# EAGLE schematic Hardware Schematic (EAGLE 7.6.0)
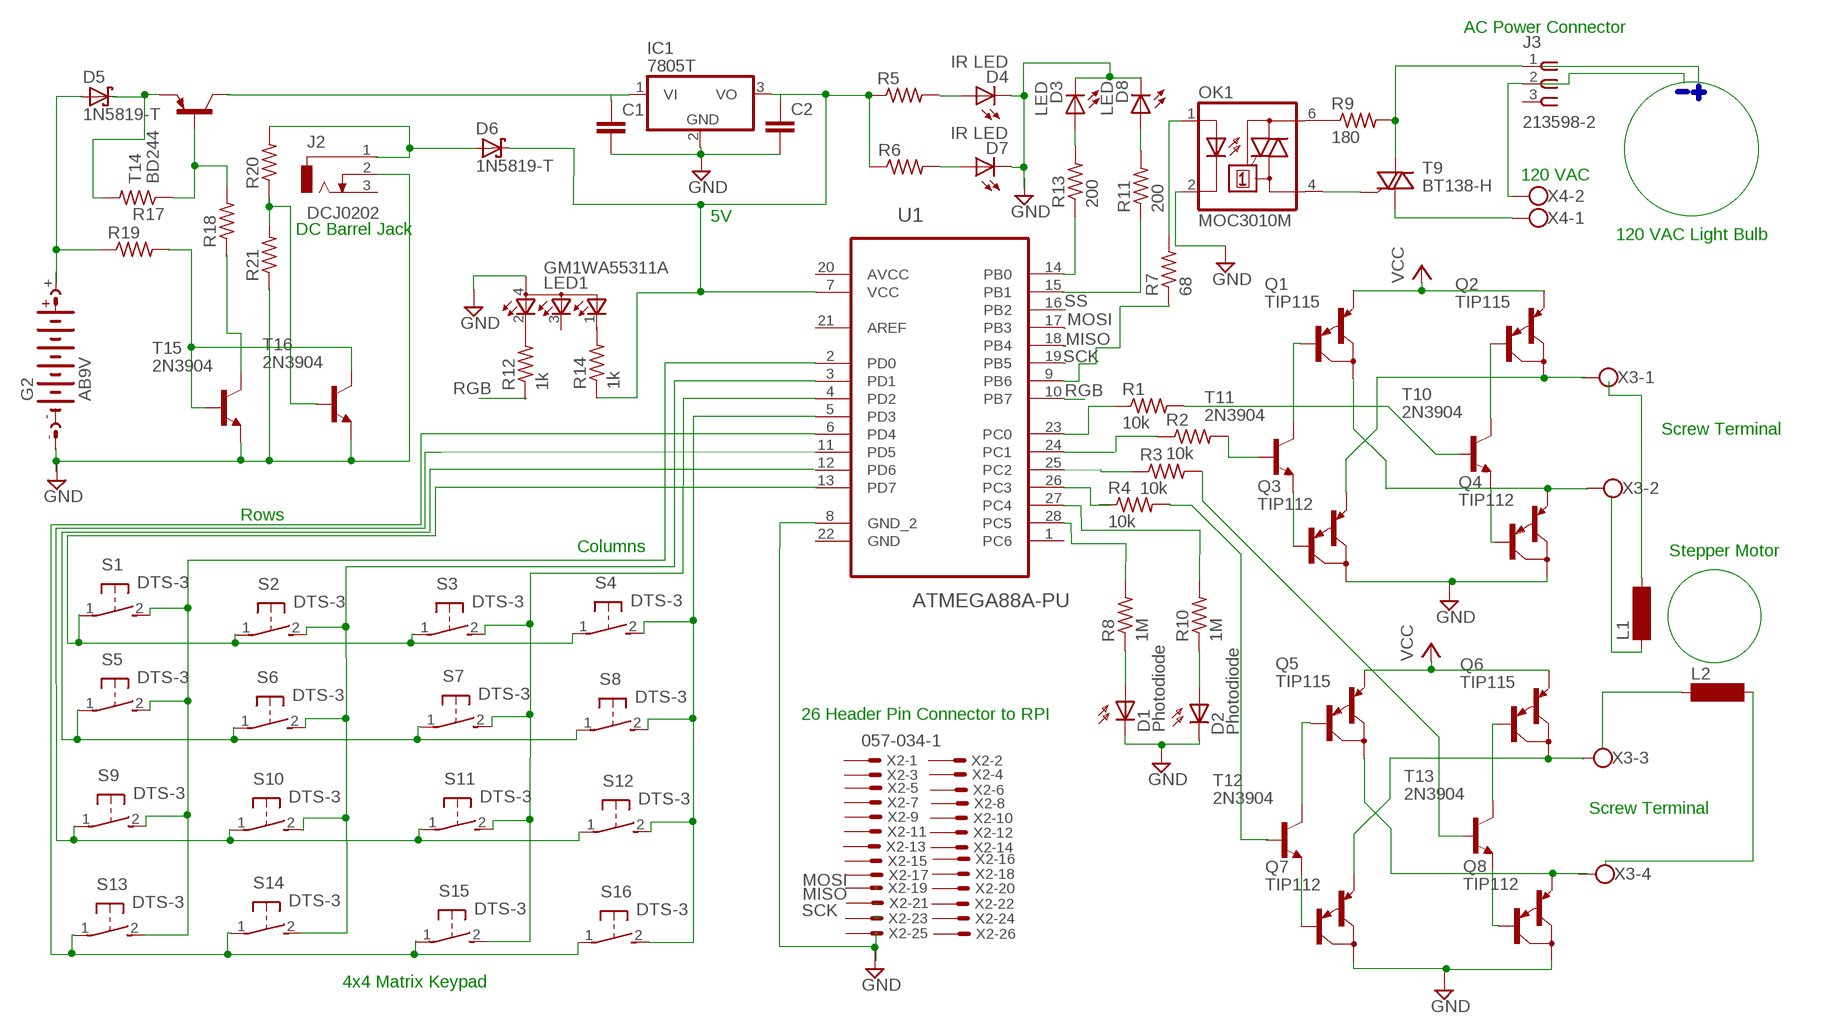
[diagram p0: schematic, sheet 1]

## Parts
C1  C22/6  [C22.5B6]
C2  C22/6  [C22.5B6]
D1  Photodiode  BPW32  [BPW32]
D2  Photodiode  BPW32  [BPW32]
D3  LED  SFH482  [SFH482]
D4  IR LED  SFH482  [SFH482]
D5  1N5819-T  [DO41-7.6]
D6  1N5819-T  [DO41-7.6]
D7  IR LED  SFH482  [SFH482]
D8  LED  SFH482  [SFH482]
G2  AB9V  [AB9V]
IC1  7805T  [TO220H]
J2  DCJ0202  [DCJ0202]
J3  213598-2  [213598-2]
L1  SM-Z15  [SM-Z15]
L2  SM-Z15  [SM-Z15]
LED1  GM1WA55311A  [GM1WA55311A]
OK1  MOC3010M  [DIL06]
Q1  TIP115  TIP125  [TO220]
Q2  TIP115  TIP125  [TO220]
Q3  TIP112  TIP125  [TO220]
Q4  TIP112  TIP125  [TO220]
Q5  TIP115  TIP125  [TO220]
Q6  TIP115  TIP125  [TO220]
Q7  TIP112  TIP125  [TO220]
Q8  TIP112  TIP125  [TO220]
R1  10k  R-US_0309/V  [0309V]
R2  10k  R-US_0309/V  [0309V]
R3  10k  R-US_0309/V  [0309V]
R4  10k  R-US_0309/V  [0309V]
R5  R-US_0309/V  [0309V]
R6  R-US_0309/V  [0309V]
R7  68  R-US_0309/12  [0309/12]
R8  1M  R-US_0309/V  [0309V]
R9  180  R-US_0309/12  [0309/12]
R10  1M  R-US_0309/V  [0309V]
R11  200  R-US_0309/V  [0309V]
R12  1k  R-US_0309/V  [0309V]
R13  200  R-US_0309/V  [0309V]
R14  1k  R-US_0309/V  [0309V]
R17  R-US_0411/15  [0411/15]
R18  R-US_0411/15  [0411/15]
R19  R-US_0411/15  [0411/15]
R20  R-US_0411/15  [0411/15]
R21  R-US_0411/15  [0411/15]
S1  DTS-3  [DTS-3]
S2  DTS-3  [DTS-3]
S3  DTS-3  [DTS-3]
S4  DTS-3  [DTS-3]
S5  DTS-3  [DTS-3]
S6  DTS-3  [DTS-3]
S7  DTS-3  [DTS-3]
S8  DTS-3  [DTS-3]
S9  DTS-3  [DTS-3]
S10  DTS-3  [DTS-3]
S11  DTS-3  [DTS-3]
S12  DTS-3  [DTS-3]
S13  DTS-3  [DTS-3]
S14  DTS-3  [DTS-3]
S15  DTS-3  [DTS-3]
S16  DTS-3  [DTS-3]
T9  BT138-H  [TO220BH]
T10  2N3904  [TO92]
T11  2N3904  [TO92]
T12  2N3904  [TO92]
T13  2N3904  [TO92]
T14  BD244  [TO220]
T15  2N3904  [TO92]
T16  2N3904  [TO92]
U1  ATMEGA88A-PU  [DIP254P762X457-28]
X2  057-034-1  [057-034-1]
X3  W237-4  [W237-4]
X4  W237-102  [W237-102]

## Nets
N$44: S16.1
N$67: R20.2
N$101: T15.2(B)
N$103: R19.1
N$105: R17.1 R18.2
N$106: J2.2 T15.3(E) T16.3(E)
N$107: R20.1
N$108: T15.1(C)
Unconnected: C1.1 C1.2 C2.1 C2.2 D1.A D1.K(C) D2.A D2.K(C) D3.A D3.K(C) D4.A D4.K(C) D5.A D5.C D6.A D6.C D7.A D7.K(C) D8.A D8.K(C) G2.+ G2.- IC1.1(VI) IC1.2(GND) IC1.3(VO) J2.1 J2.3 J3.1 J3.2 J3.3 L1.1 L1.2 L2.1 L2.2 LED1.1(CGREEN) LED1.2(CRED) LED1.3(CBLUE) LED1.4(A) OK1.1(A) OK1.2(C) OK1.4(A1) OK1.6(A2) Q1.1(B) Q1.2(C) Q1.3(E) Q2.1(B) Q2.2(C) Q2.3(E) Q3.1(B) Q3.2(C) Q3.3(E) Q4.1(B) Q4.2(C) Q4.3(E) Q5.1(B) Q5.2(C) Q5.3(E) Q6.1(B) Q6.2(C) Q6.3(E) Q7.1(B) Q7.2(C) Q7.3(E) Q8.1(B) Q8.2(C) Q8.3(E) R1.1 R1.2 R2.1 R2.2 R3.1 R3.2 R4.1 R4.2 R5.1 R5.2 R6.1 R6.2 R7.1 R7.2 R8.1 R8.2 R9.1 R9.2 R10.1 R10.2 R11.1 R11.2 R12.1 R12.2 R13.1 R13.2 R14.1 R14.2 R17.2 R18.1 R19.2 R21.1 R21.2 S1.1 S1.2 S2.1 S2.2 S3.1 S3.2 S4.1 S4.2 S5.1 S5.2 S6.1 S6.2 S7.1 S7.2 S8.1 S8.2 S9.1 S9.2 S10.1 S10.2 S11.1 S11.2 S12.1 S12.2 S13.1 S13.2 S14.1 S14.2 S15.1 S15.2 S16.2 T9.G T9.T1(A1) T9.T2(A2) T10.1(C) T10.2(B) T10.3(E) T11.1(C) T11.2(B) T11.3(E) T12.1(C) T12.2(B) T12.3(E) T13.1(C) T13.2(B) T13.3(E) T14.1(B) T14.2(C) T14.3(E) T16.1(C) T16.2(B) U1.1(PC6) U1.2(PD0) U1.3(PD1) U1.4(PD2) U1.5(PD3) U1.6(PD4) U1.8(GND_2) U1.9(PB6) U1.10(PB7) U1.11(PD5) U1.12(PD6) U1.13(PD7) U1.14(PB0) U1.15(PB1) U1.16(PB2) U1.17(PB3) U1.18(PB4) U1.19(PB5) U1.21(AREF) U1.22(GND) U1.23(PC0) U1.24(PC1) U1.25(PC2) U1.26(PC3) U1.27(PC4) U1.28(PC5) X2.1 X2.2 X2.3 X2.4 X2.5 X2.6 X2.7 X2.8 X2.9 X2.10 X2.11 X2.12 X2.13 X2.14 X2.15 X2.16 X2.17 X2.18 X2.19 X2.20 X2.21 X2.22 X2.23 X2.24 X2.25 X2.26 X2.27 X2.28 X2.29 X2.30 X2.31 X2.32 X2.33 X2.34 X3.1 X3.2 X3.3 X3.4 X4.1 X4.2

## Buses
B$1
B$2
B$3

## Notes on the sheet
- AC Power Connector
- 120 VAC
- 5V
- DC Barrel Jack
- 120 VAC Light Bulb
- Screw Terminal
- Rows
- Columns | Stepper Motor
- 26 Header Pin Connector to RPI
- Screw Terminal
- 4x4 Matrix Keypad

## Power pins joined to a net without a drawn wire
AVCC: U1.20(AVCC)
VCC: U1.7(VCC)

## Library data of the parts
C1 C2 = capacitor-wima:C: CAPACITOR naming: grid - package width
D1 D2 = opto-trans-siemens:BPW32: PHOTO DIODE; OC_FARNELL: unknown; OC_NEWARK: unknown
D3 D4 D7 D8 = led:SFH482: IR LED infrared emitting diode, Infineon
D5 D6 = diode:1N581*: 1.0A SCHOTTKY BARRIER RECTIFIER Source: http://www.diodes.com/datasheets/ds23001.pdf
G2 = battery:AB9V: 9-V BATTERY CLIP
IC1 = linear:78*: Positive VOLTAGE REGULATOR Source: http://cache.national.com/ds/LM/LM78L05.pdf http://www.fairchildsemi.com/ds/LM/LM7805.pdf
J2 = con-jack:DCJ0202: DC POWER JACK Source: DCJ0202.pdf; OC_FARNELL: unknown; OC_NEWARK: unknown
J3 = con-amp:213598-2: AC Jack Source: ENG_CD_213598_M.pdf
L1 L2 = inductor-neosid:SM-Z15: INDUCTOR SMD rod core choke; OC_FARNELL: unknown; OC_NEWARK: unknown
LED1 = led:GM1WA55311A: Chip LED RGB Source: http://document.sharpsma.com/files/GM1WA55311A_SS.pdf
OK1 = optocoupler:MOC30*M: RANDOM-PHASE OPTOISOLATORS TRIAC DRIVER OUTPUT Source: http://www.fairchildsemi.com MOC3020-M.pdf; MF: FAIRCHILD SEMICONDUCTOR; MPN: MOC3010-M; OC_FARNELL: 1505423; OC_NEWARK: 72K8892
Q1-Q8 = transistor-pnp:TIP125: PNP Transistor
R1-R14 R17-R21 = rcl:R-US_: RESISTOR, American symbol
S1-S16 = switch-tact:DTS-3
T9 = triac:BT138: TRIAC Source: http://www.semiconductors.philips.com BT138_SERIES_2.pdf
T10-T13 T15 T16 = transistor:2N3904: NPN TRANSISTOR
T14 = transistor:BD244: PNP TRANSISTOR Source: Motorola Semiconductor, Master Selection Guide Q3/95 SG73 REV 8 page 5.5-5
U1 = Atmel_By_element14_Batch_1-00:ATMEGA88A-PU: MCU; DESCRIPTION: MCU; MPN: ATMEGA88A-PU; OC_FARNELL: 1841615; OC_NEWARK: 12T1304; PACKAGE: DIP-28; SUPPLIER: Atmel
X2 = con-panduit:057-034-: CONNECTOR 34-pin series 057 contact pc board low profile headers; OC_FARNELL: unknown; OC_NEWARK: unknown
X3 = con-wago-500:W237-4: WAGO SCREW CLAMP; OC_FARNELL: unknown; OC_NEWARK: unknown
X4 = con-wago-500:W237-102: WAGO SCREW CLAMP; MPN: 237-102; OC_FARNELL: unknown; OC_NEWARK: 70K9898